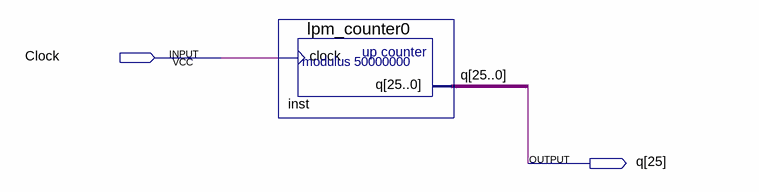
[diagram p0: schematic sheet]
// Quartus schematic DivFre.bdf as structural Verilog: 1 symbols, 2 pins
module DivFre (
  input  Clock,
  output [25:0] q
);

  lpm_counter0 inst (.clock(Clock), .q(q));
endmodule
